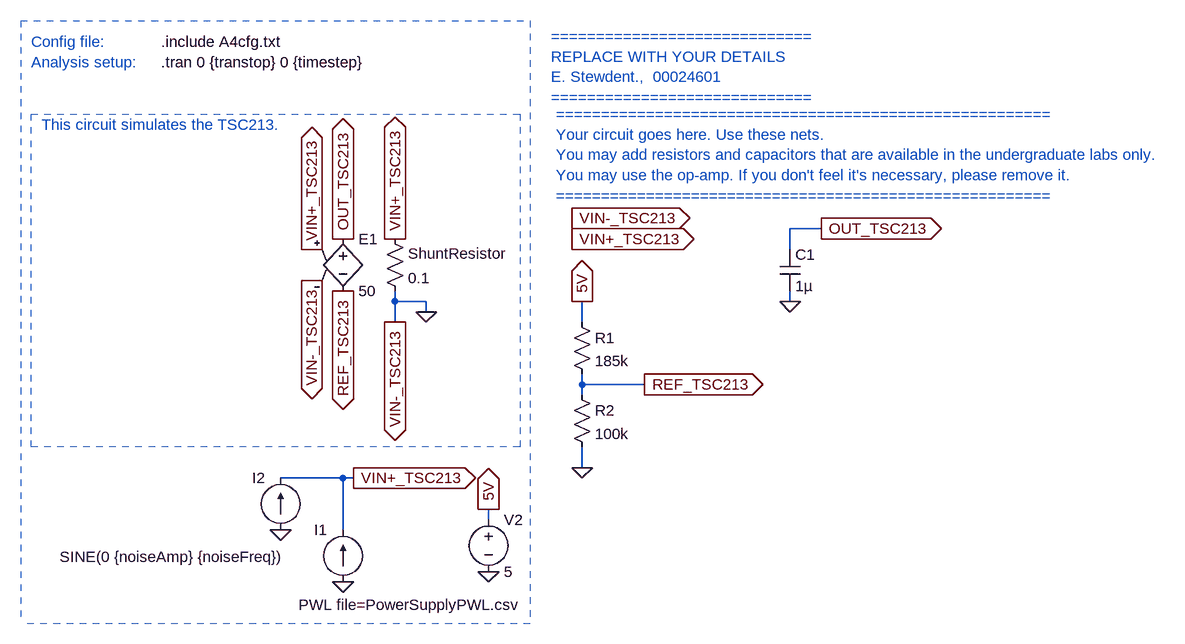
[diagram p0: schematic E344_22738002_A4.asc]
E344_22738002_A4.asc, the LTspice schematic file:
Version 4
SHEET 1 1824 680
WIRE -1136 -1104 -1184 -1104
WIRE -1184 -1072 -1184 -1104
WIRE -1792 -992 -1792 -1008
WIRE -1744 -992 -1792 -992
WIRE -1184 -992 -1184 -1008
WIRE -1744 -976 -1744 -992
WIRE -1792 -960 -1792 -992
WIRE -1504 -960 -1504 -992
WIRE -1504 -864 -1504 -880
WIRE -1408 -864 -1504 -864
WIRE -1504 -848 -1504 -864
WIRE -1504 -736 -1504 -768
WIRE -1872 -720 -1968 -720
WIRE -1856 -720 -1872 -720
WIRE -1648 -656 -1648 -672
WIRE -1872 -640 -1872 -720
FLAG -1648 -672 5V
IOPIN -1648 -672 Out
FLAG -1648 -576 0
FLAG -1136 -1104 OUT_TSC213
IOPIN -1136 -1104 Out
FLAG -1520 -1120 VIN-_TSC213
IOPIN -1520 -1120 Out
FLAG -1520 -1088 VIN+_TSC213
IOPIN -1520 -1088 Out
FLAG -1872 -560 0
FLAG -1792 -1088 VIN+_TSC213
IOPIN -1792 -1088 Out
FLAG -1792 -960 VIN-_TSC213
IOPIN -1792 -960 Out
FLAG -1920 -1024 VIN-_TSC213
IOPIN -1920 -1024 Out
FLAG -1920 -1072 VIN+_TSC213
IOPIN -1920 -1072 Out
FLAG -1872 -1008 REF_TSC213
IOPIN -1872 -1008 Out
FLAG -1872 -1088 OUT_TSC213
IOPIN -1872 -1088 Out
FLAG -1856 -720 VIN+_TSC213
IOPIN -1856 -720 Out
FLAG -1968 -640 0
FLAG -1504 -992 5V
IOPIN -1504 -992 Out
FLAG -1504 -736 0
FLAG -1744 -976 0
FLAG -1408 -864 REF_TSC213
IOPIN -1408 -864 Out
FLAG -1184 -992 0
SYMBOL e -1872 -1104 R0
SYMATTR InstName E1
SYMATTR Value 50
SYMBOL current -1872 -560 R180
WINDOW 0 24 80 Left 2
WINDOW 3 -271 -35 Left 2
WINDOW 123 0 0 Left 0
WINDOW 39 0 0 Left 0
SYMATTR InstName I1
SYMATTR Value PWL file=PowerSupplyPWL.csv
SYMBOL res -1808 -1104 R0
WINDOW 0 36 38 Left 2
SYMATTR InstName ShuntResistor
SYMATTR Value 0.1
SYMBOL voltage -1648 -672 R0
WINDOW 123 0 0 Left 0
WINDOW 39 0 0 Left 0
SYMATTR InstName V2
SYMATTR Value 5
SYMBOL current -1968 -640 R180
WINDOW 0 24 80 Left 2
WINDOW 3 -7 -41 Left 2
WINDOW 123 0 0 Left 0
WINDOW 39 0 0 Left 0
SYMATTR InstName I2
SYMATTR Value SINE(0 {noiseAmp} {noiseFreq})
SYMBOL res -1520 -976 R0
SYMATTR InstName R1
SYMATTR Value 185k
SYMBOL res -1520 -864 R0
SYMATTR InstName R2
SYMATTR Value 100k
SYMBOL cap -1200 -1072 R0
SYMATTR InstName C1
SYMATTR Value 1µ
TEXT -2152 -1360 Left 2 !.tran 0 {transtop} 0 {timestep}
TEXT -2152 -1392 Left 2 !.include A4cfg.txt
TEXT -2352 -1392 Left 2 ;Config file:
TEXT -2352 -1360 Left 2 ;Analysis setup:
TEXT -1552 -1400 Left 2 ;=============================\nREPLACE WITH YOUR DETAILS\nE. Stewdent.,  00024601\n=============================
TEXT -1544 -1280 Left 2 ;=======================================================\nYour circuit goes here. Use these nets.\nYou may add resistors and capacitors that are available in the undergraduate labs only.\nYou may use the op-amp. If you don't feel it's necessary, please remove it.\n=======================================================
TEXT -2336 -1264 Left 2 ;This circuit simulates the TSC213.
LINE Normal -1584 -1424 -1584 -496 2
LINE Normal -2368 -1424 -1584 -1424 2
LINE Normal -1584 -496 -2368 -496 2
LINE Normal -1584 -512 -1584 -512 2
LINE Normal -2368 -1424 -2368 -496 2
RECTANGLE Normal -2352 -1280 -1600 -768 2

The netlist it stands for:
* E344_22738002_A4.asc
E1 OUT_TSC213 REF_TSC213 VIN+_TSC213 0 50
I1 0 VIN+_TSC213 PWL file=PowerSupplyPWL.csv
R§ShuntResistor VIN+_TSC213 0 0.1
V2 5V 0 5
I2 0 VIN+_TSC213 SINE(0 {noiseAmp} {noiseFreq})
R1 5V REF_TSC213 185k
R2 REF_TSC213 0 100k
C1 OUT_TSC213 0 1µ
.tran 0 {transtop} 0 {timestep}
.include A4cfg.txt
* Config file:
* Analysis setup:
* =============================
* REPLACE WITH YOUR DETAILS
* E. Stewdent.,  00024601
* =============================
* =======================================================
* Your circuit goes here. Use these nets.
* You may add resistors and capacitors that are available in the undergraduate labs only.
* You may use the op-amp. If you don't feel it's necessary, please remove it.
* =======================================================
* This circuit simulates the TSC213.
.backanno
.end